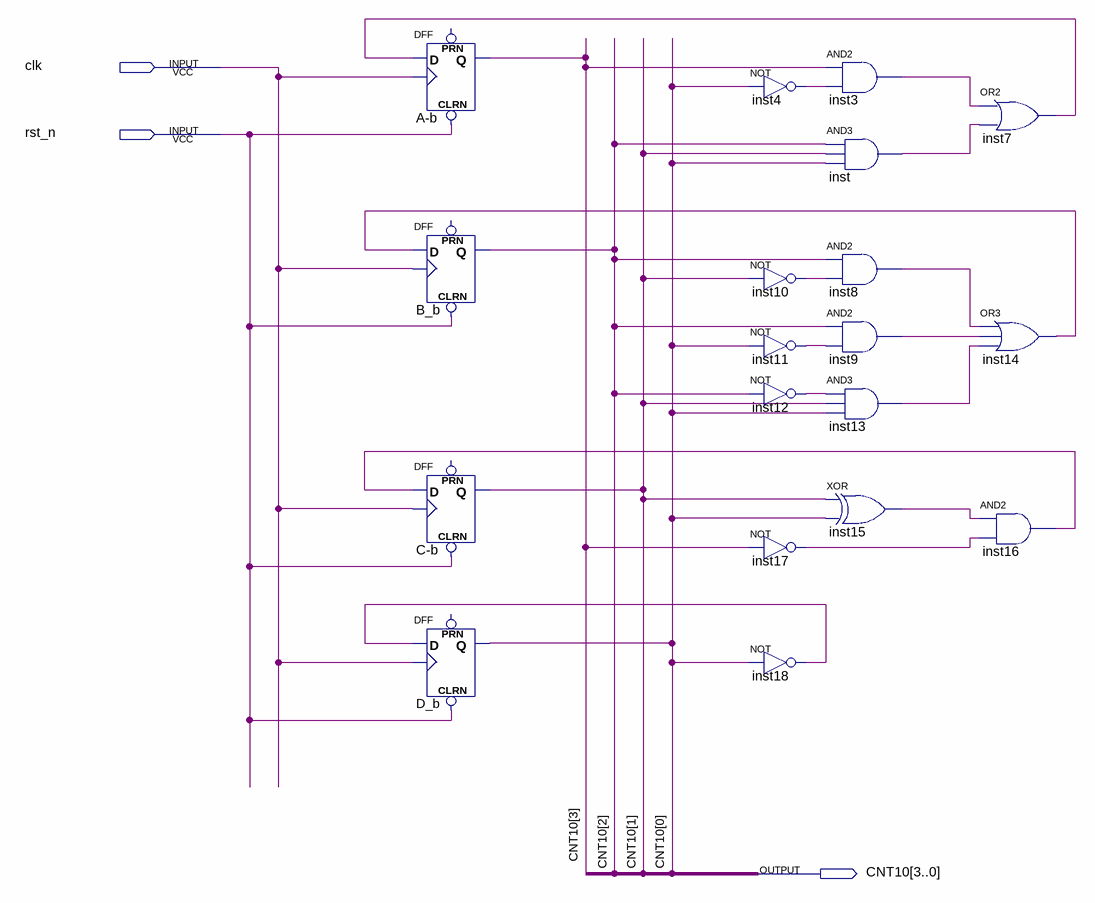
[diagram p0: schematic sheet]
// Quartus schematic CNT10.bdf as structural Verilog: 19 symbols, 3 pins
module CNT10 (
  input  clk,
  input  rst_n,
  output [3:0] CNT10
);

  wire inst3_out, inst4_out, inst7_out, inst8_out, inst9_out, inst10_out, inst11_out, inst12_out, inst13_out,
       inst14_out, inst15_out, inst16_out, inst17_out, inst18_out, inst_out;

  DFF \A-b  (.CLRN(rst_n), .CLK(clk), .D(inst7_out), .Q(CNT10[3]));  // open: PRN
  DFF B_b (.CLRN(rst_n), .CLK(clk), .D(inst14_out), .Q(CNT10[2]));  // open: PRN
  DFF \C-b  (.CLRN(rst_n), .CLK(clk), .D(inst16_out), .Q(CNT10[1]));  // open: PRN
  DFF D_b (.CLRN(rst_n), .CLK(clk), .D(inst18_out), .Q(CNT10[0]));  // open: PRN
  not inst4 (inst4_out, CNT10[0]);
  not inst10 (inst10_out, CNT10[1]);
  not inst11 (inst11_out, CNT10[0]);
  not inst12 (inst12_out, CNT10[2]);
  not inst17 (inst17_out, CNT10[3]);
  not inst18 (inst18_out, CNT10[0]);
  and inst3 (inst3_out, CNT10[3], inst4_out);
  and inst (inst_out, CNT10[2], CNT10[1], CNT10[0]);
  and inst8 (inst8_out, CNT10[2], inst10_out);
  and inst9 (inst9_out, CNT10[2], inst11_out);
  and inst13 (inst13_out, inst12_out, CNT10[1], CNT10[0]);
  xor inst15 (inst15_out, CNT10[1], CNT10[0]);
  or inst7 (inst7_out, inst3_out, inst_out);
  or inst14 (inst14_out, inst8_out, inst9_out, inst13_out);
  and inst16 (inst16_out, inst15_out, inst17_out);
endmodule
